# Altium schematic sheet 菜单顶板.SchDoc
size A4
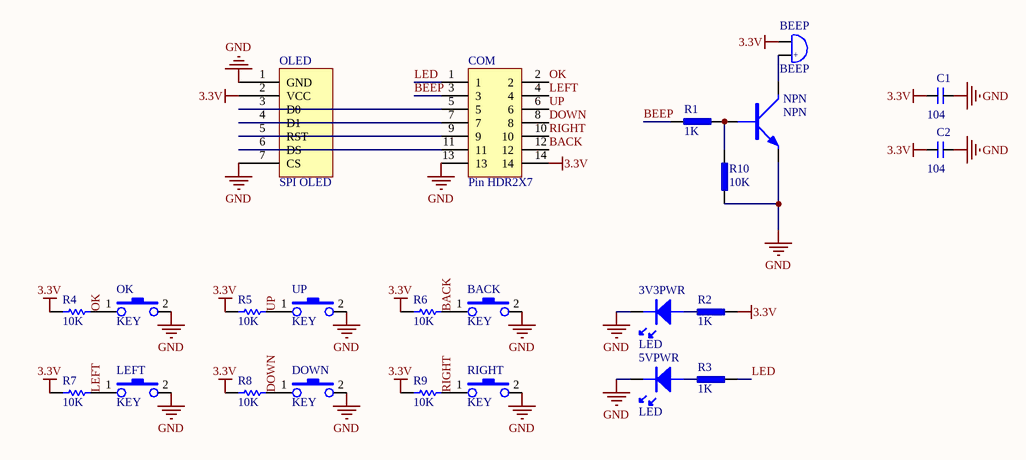
[diagram p0: 菜单顶板.SchDoc]

## Parts
3V3PWR  LED  [LED-0805B]
5VPWR  LED  [LED-0805B]
BACK  KEY  [anjian]
BEEP  BEEP  [BEEP 6.5x12x6]
C1  104  [C 0805]
C2  104  [C 0805]
COM  Pin HDR2X7  [Pin HDR2X7/2.54mm-S]
DOWN  KEY  [anjian]
LEFT  KEY  [anjian]
NPN  NPN  [SOT-23]
OK  KEY  [anjian]
OLED  SPI OLED  [OLED12864]
R1  1K  [R 0805]
R2  1K  [R 0805]
R3  1K  [R 0805]
R4  10K  [0805R]
R5  10K  [0805R]
R6  10K  [0805R]
R7  10K  [0805R]
R8  10K  [0805R]
R9  10K  [0805R]
R10  10K  [R 0805]
RIGHT  KEY  [anjian]
UP  KEY  [anjian]

## Nets
3.3V: BEEP.2 C1.1 C2.1 COM.14 OLED.2(VCC) R2.1 R4.1 R5.1 R6.1 R7.1 R8.1 R9.1
GND: 3V3PWR.K 5VPWR.K BACK.2 C1.2 C2.2 COM.13 DOWN.2 LEFT.2 NPN.E OK.2 OLED.1(GND) OLED.7(CS) R10.1 RIGHT.2 UP.2
BACK: BACK.1 COM.12 R6.2
BEEP: COM.3 R1.1
DOWN: COM.8 DOWN.1 R8.2
LED: COM.1 R3.1
LEFT: COM.4 LEFT.1 R7.2
OK: COM.2 OK.1 R4.2
RIGHT: COM.10 R9.2 RIGHT.1
UP: COM.6 R5.2 UP.1
Net3V3PWR_A: 3V3PWR.A R2.2
Net5VPWR_A: 5VPWR.A R3.2
NetBEEP_1: BEEP.1 NPN.C
NetCOM_5: COM.5 OLED.3(D0)
NetCOM_7: COM.7 OLED.4(D1)
NetCOM_9: COM.9 OLED.5(RST)
NetCOM_11: COM.11 OLED.6(DS)
NetNPN_B: NPN.B R1.2 R10.2

## Notes on the sheet
- (in symbol BEEP) +

## Library data of the parts
BEEP = BEEP: 蜂鸣器
C1 C2 = CAP
NPN = NPN: NPN三极管
R1-R10 = RES